# Altium project PCB_RMII_Dongle.PrjPcb
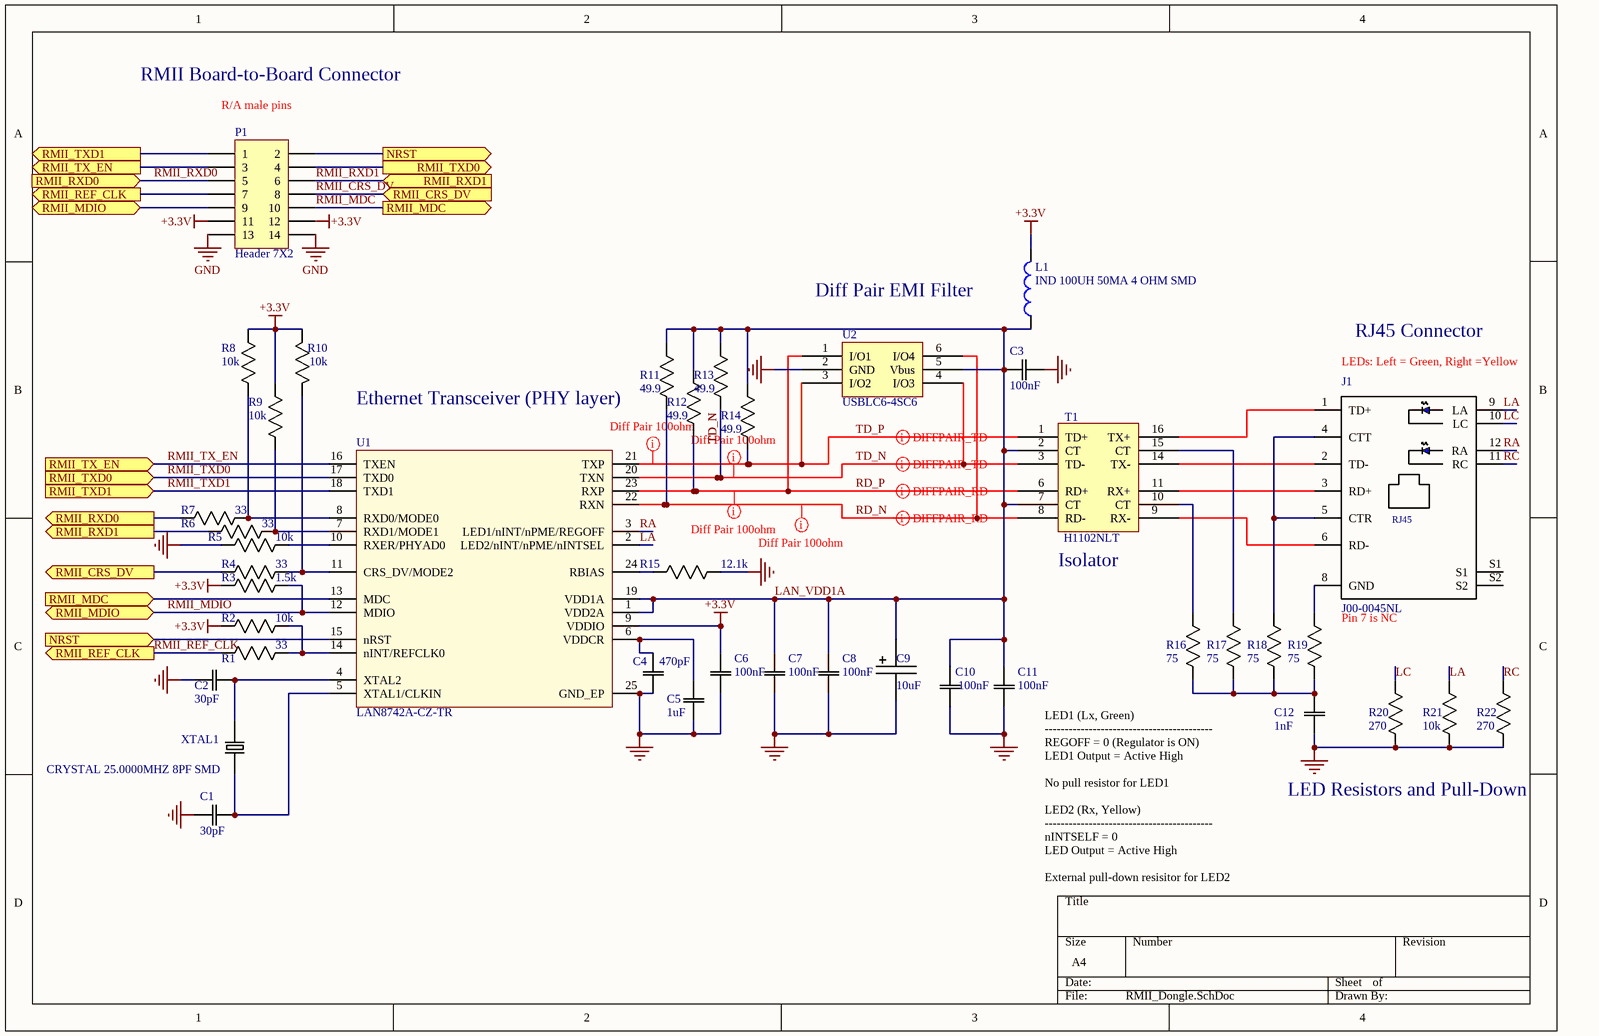
[diagram p0: RMII_Dongle.SchDoc]
1 sheet, 41 parts. Net scope: flat (ports and power ports of the same name join across sheets).
Board file: RMII_Dongle.PcbDoc

## Sheet RMII_Dongle.SchDoc
size A4

### Parts
C1  30pF  [0805]
C2  30pF  [0805]
C3  100nF  [0805]
C4  470pF  [0805]
C5  1uF  [0805]
C6  100nF  [0805]
C7  100nF  [0805]
C8  100nF  [0805]
C9  10uF  [1206 Polarized]
C10  100nF  [0805]
C11  100nF  [0805]
C12  1nF  [0805]
J1  J00-0045NL  [RJ45 J00-0045NL]
L1  IND 100UH 50MA 4 OHM SMD  [0805]
P1  Header 7X2  [HDR2X7]
R1  33  [0805]
R2  10k  [0805]
R3  1.5k  [0805]
R4  33  [0805]
R5  10k  [0805]
R6  33  [0805]
R7  33  [0805]
R8  10k  [0805]
R9  10k  [0805]
R10  10k  [0805]
R11  49.9  [0805]
R12  49.9  [0805]
R13  49.9  [0805]
R14  49.9  [0805]
R15  12.1k  [0805]
R16  75  [0805]
R17  75  [0805]
R18  75  [0805]
R19  75  [0805]
R20  270  [0805]
R21  10k  [0805]
R22  270  [0805]
T1  H1102NLT  [TRANSFORMER]
U1  LAN8742A-CZ-TR  [24-QFN (4x4)]
U2  USBLC6-4SC6  [SOT23-6L]
XTAL1  CRYSTAL 25.0000MHZ 8PF SMD  [SMD-2]

### Ports
NRST (in), NRST (out), RMII_CRS_DV (in), RMII_CRS_DV (out), RMII_MDC (in), RMII_MDC (out), RMII_MDIO (bidir), RMII_REF_CLK (out), RMII_RXD0 (in), RMII_RXD0 (out), RMII_RXD1 (in), RMII_RXD1 (out), RMII_TX_EN (in), RMII_TX_EN (out), RMII_TXD0 (in), RMII_TXD0 (out), RMII_TXD1 (in), RMII_TXD1 (out)

### Nets
+3.3V: C6.2(C2) L1.2 P1.11 P1.12 R2.2(R2) R3.2(R2) R8.1(R1) R9.1(R1) R10.1(R1) U1.9(VDDIO)
GND: C1.1(C1) C2.1(C1) C3.2(C2) C4.1(C1) C5.1(C1) C6.1(C1) C7.1(C1) C8.1(C1) C9.2(P$2) C10.1(C1) C11.1(C1) C12.1(C1) P1.13 P1.14 R5.2(R2) R15.1(R1) R20.2(R2) R21.2(R2) R22.2(R2) U1.25(GND_EP) U2.2(GND)
LA: J1.9(LA) R21.1(R1) U1.2(LED2/nINT/nPME/nINTSEL)
LAN_VDD1A: C3.1(C1) C7.2(C2) C8.2(C2) C9.1(P$1) C10.2(C2) C11.2(C2) L1.1 R11.1(R1) R12.1(R1) R13.1(R1) R14.1(R1) T1.2(CT) T1.7(CT) U1.1(VDD2A) U1.19(VDD1A) U2.5(Vbus)
LC: J1.10(LC) R20.1(R1)
RA: J1.12(RA) U1.3(LED1/nINT/nPME/REGOFF)
RC: J1.11(RC) R22.1(R1)
RD_N: R11.2(R2) T1.8(RD-) U1.22(RXN) U2.6(I/O4)
RD_P: R12.2(R2) T1.6(RD+) U1.23(RXP) U2.1(I/O1)
RMII_CRS_DV: P1.8 R4.2(R2) ; port RMII_CRS_DV
RMII_MDC: P1.10 U1.13(MDC) ; port RMII_MDC
RMII_MDIO: P1.9 R3.1(R1) U1.12(MDIO) ; port RMII_MDIO
RMII_REF_CLK: P1.7 R1.2(R2) ; port RMII_REF_CLK
RMII_RXD0: P1.5 R7.2(R2) ; port RMII_RXD0
RMII_RXD1: P1.6 R6.2(R2) ; port RMII_RXD1
RMII_TX_EN: P1.3 U1.16(TXEN) ; port RMII_TX_EN
RMII_TXD0: P1.4 U1.17(TXD0) ; port RMII_TXD0
RMII_TXD1: P1.1 U1.18(TXD1) ; port RMII_TXD1
TD_N: R13.2(R2) T1.3(TD-) U1.20(TXN) U2.4(I/O3)
TD_P: R14.2(R2) T1.1(TD+) U1.21(TXP) U2.3(I/O2)
NetC1_2: C1.2(C2) U1.5(XTAL1/CLKIN) XTAL1.1
NetC2_2: C2.2(C2) U1.4(XTAL2) XTAL1.2
NetC4_2: C4.2(C2) C5.2(C2) U1.6(VDDCR)
NetC12_2: C12.2(C2) R16.2(R2) R17.2(R2) R18.2(R2) R19.2(R2)
NetJ1_1: J1.1(TD+) T1.16(TX+)
NetJ1_2: J1.2(TD-) T1.14(TX-)
NetJ1_3: J1.3(RD+) T1.11(RX+)
NetJ1_4: J1.4(CTT) J1.5(CTR) R18.1(R1)
NetJ1_6: J1.6(RD-) T1.9(RX-)
NetJ1_8: J1.8(GND) R19.1(R1)
NetP1_2: P1.2 U1.15(nRST) ; port NRST
NetR1_1: R1.1(R1) R2.1(R1) U1.14(nINT/REFCLK0)
NetR4_1: R4.1(R1) R10.2(R2) U1.11(CRS_DV/MODE2)
NetR5_1: R5.1(R1) U1.10(RXER/PHYAD0)
NetR6_1: R6.1(R1) R9.2(R2) U1.7(RXD1/MODE1)
NetR7_1: R7.1(R1) R8.2(R2) U1.8(RXD0/MODE0)
NetR15_2: R15.2(R2) U1.24(RBIAS)
NetR16_1: R16.1(R1) T1.10(CT)
NetR17_1: R17.1(R1) T1.15(CT)

Not connected (* = marked no-connect by the designer): J1 S1 S2

### Layout directives
differential pair: RD_N, RD_P, TD_N, TD_P
rule Matched Net Lengths [Tolerance = 100mil]: RD_N, RD_P, TD_N, TD_P

### Notes on the sheet
- RMII Board-to-Board Connector
- (near P1) R/A male pins
- (near L1) Diff Pair EMI Filter
- (near J1) LEDs: Left = Green, Right =Yellow
- RJ45 Connector
- (near R11) Ethernet Transceiver (PHY layer)
- (near T1) Isolator
- Pin 7 is NC
- LED Resistors and Pull-Down
- LED1 (Lx, Green)
  ------------------------------------------
  REGOFF = 0 (Regulator is ON)
  LED1 Output = Active High
  No pull resistor for LED1
  LED2 (Rx, Yellow)
  ------------------------------------------
  nINTSELF = 0
  LED Output = Active High
  External pull-down resisitor for LED2
- (in symbol J00-0045NL) RJ45

### Library data of the parts
C1 C2 = CAP 30pF 0805: CAP CER 30PF 25V NP0 0805; MP: C0805C300M3GAC7800; MF: Yageo; Tolerance: 20%; Package: 0805; Price: 0.43 CAD; Value: 30pF; Digikey: 399-17444-1-ND; Digikey Link: https://www.digikey.ca/product-detail/en/kemet/C0805C300M3GAC7800/399-17444-1-ND/8570411; Rating: 25V
C3 C6-C8 C10 C11 = CAP 100nF 0805: CAP CER 0.1UF 50V X7R 0805; MP: CC0805KRX7R9BB104; MF: Yageo; Tolerance: 10%; Package: 0805; Price: 0,119 CAD; Value: 100nF; Digikey: 311-1140-1-ND; Digikey Link: https://www.digikey.ca/products/en?keywords=311-1140-1-ND; Rating: 50V
C4 = CAP 470pF 0805: CAP CER 470PF 50V C0G/NPO 0805; MP: CC0805JRNPO9BN471; MF: Yageo; Tolerance: 5%; Package: 0805; Price: 0,135 CAD; Value: 470pF; Digikey: 311-1119-1-ND; Digikey Link: https://www.digikey.ca/products/en?keywords=311-1119-1-ND; Rating: 50V
C5 = CAP 1uF 0805: CAP CER 1UF 50V X7R 0805; MP: CL21B105KBFNNNE; MF: Samsung Electro-Mechanics; Tolerance: 10%; Package: 0805; Price: 0,172 CAD; Value: 1uF; Digikey: 1276-1029-1-ND; Digikey Link: https://www.digikey.ca/product-detail/en/samsung-electro-mechanics/CL21B105KBFNNNE/1276-1029-1-ND/3889115; Rating: 50V
C9 = CAP TANT 10UF 1206: 10µF Molded Tantalum Capacitors 10V 1206 (3216 Metric) 3.8Ohm; MP: T491A106K010AT; MF: KEMET; Price: 0.59 CAD; Package: 1206 KEMET; Value: 10uF; Digikey: 399-3684-1-ND; Digikey Link: https://www.digikey.ca/product-detail/en/kemet/T491A106K010AT/399-3684-1-ND/819009
C12 = CAP 1nF 0805: CAP CER 1000PF 50V X7R 0805; MP: CC0805KRX7R9BB102; MF: Yageo; Tolerance: 10%; Package: 0805; Price: 0.1 CAD; Value: 1nF; Digikey: 311-1127-1-ND; Digikey Link: https://www.digikey.ca/products/en?keywords=311-1127-1-ND; Rating: 50V
J1 = J00-0045NL: 1 Port RJ45 Magjack Connector Through Hole 10/100 Base-TX, AutoMDIX; MF: Pulse Electronics; Package: None; SnapEDA_Link: https://www.snapeda.com/parts/J00-0045NL/Pulse%20Electronics%20Network/view-part/87956/?ref=snap; MP: J00-0045NL; Value: *; Digikey Link: https://www.digikey.com/product-detail/en/pulse-electronics-network/J00-0045NL/553-1619-5-ND/1036860?utm_source=snapeda&utm_medium=aggregator&utm_campaign=symbol; Digikey: 553-1619-5-ND
L1 = IND 100UH 50MA 4 OHM SMD: 100µH Unshielded Wirewound Inductor 50mA 4Ohm 0805 (2012 Metric); MF: Taiyo Yuden; MP: LBR2012T101K; Revision: July-2002: Re-released for DXP Platform.; Value: 100uH; Digikey: 587-2048-1-ND; Digikey Link: https://www.digikey.ca/product-detail/en/taiyo-yuden/LBR2012T101K/587-2048-1-ND/1788995
P1 = Header 7X2: Header, 7-Pin, Dual row; LatestRevisionDate: 17-Jul-2002; LatestRevisionNote: Re-released for DXP Platform.; Publisher: Altium Limited
R1 R4 R6 R7 = RES 33 0805: RES SMD 33 OHM 1% 1/8W 0805; MP: RC0805FR-0733RL; MF: Yageo; Rating: 0.125W; Digikey: 311-33.0CRCT-ND; Price: 0.15 CAD; Package: 0805; Value: 33; Digikey Link: https://www.digikey.ca/product-detail/en/yageo/RC0805FR-0733RL/311-33.0CRCT-ND/730809
R2 R5 R8-R10 R21 = RES 10k 0805: RES SMD 10K OHM 1% 1/8W 0805; MP: RC0805FR-0710KL; MF: Yageo; Rating: 0.125W; Digikey: 311-10.0KCRCT-ND; Price: 0.061 CAD; Package: 0805; Value: 10k; Digikey Link: https://www.digikey.ca/products/en?keywords=311-10.0KCRCT-ND; Tolerance: 1%
R3 = RES 1.5k 0805: RES SMD 1.5K OHM 1% 1/8W 0805; MP: RC0805FR-071K5L; MF: Yageo; Rating: 0.125W; Digikey: 311-1.50KCRCT-ND; Price: 0.15 CAD; Package: 0805; Value: 1.5k; Digikey Link: https://www.digikey.ca/product-detail/en/yageo/RC0805FR-071K5L/311-1.50KCRCT-ND/730443; Tolerance: 1%; ComponentLink1Description: digikey; ComponentLink1URL: https://www.digikey.ca/en/products/detail/panasonic-electronic-components/ERJ-6ENF1022V/111476
R11-R14 = RES 49.9 0805: RES SMD 49.9 OHM 1% 1/8W 0805; MP: RC0805FR-0749R9L; MF: Yageo; Rating: 0.125W; Digikey: 311-49.9CRCT-ND; Price: 0.15 CAD; Package: 0805; Value: 49.9; Digikey Link: https://www.digikey.ca/product-detail/en/yageo/RC0805FR-0749R9L/311-49.9CRCT-ND/730931; Tolerance: 1%
R15 = RES 12.1k 0805: RES SMD 12.1K OHM 1% 1/8W 0805; MP: RC0805FR-0712K1L; MF: Yageo; Rating: 0.125W; Digikey: 311-12.1KCRCT-ND; Price: 0.15 CAD; Package: 0805; Value: 12.1k; Digikey Link: https://www.digikey.ca/product-detail/en/yageo/RC0805FR-0712K1L/311-12.1KCRCT-ND/730517; Tolerance: 1%
R16-R19 = RES 75 0805: RES SMD 75 OHM 1% 1/8W 0805; MP: RC0805FR-0775RL; MF: Yageo; Rating: 0.125W; Digikey: 311-75.0CRCT-ND; Price: 0.15 CAD; Package: 0805; Value: 75; Digikey Link: https://www.digikey.ca/product-detail/en/yageo/RC0805FR-0775RL/311-75.0CRCT-ND/731079; Tolerance: 1%
R20 R22 = RES 270 0805: RES SMD 270 OHM 5% 1/8W 0805; MP: RC0805JR-07270RL; MF: Yageo; Rating: 0.125W; Digikey: 311-270ARCT-ND; Price: 0.054 CAD; Package: 0805; Value: 270; Digikey Link: https://www.digikey.ca/product-detail/en/yageo/RC0805JR-07270RL/311-270ARCT-ND/731238
T1 = H1102NLT: Isolation and Data Interface _Encapsulated_ Pulse Transformer 1:1 Transmitter, 1:1 Receiver Surface Mount; MF: Pulse Electronics; Package: SOIC-16; Price: 7.99 CAD; MP: H1102NL; Digikey: 553-1323-5-ND; Digikey Link: https://www.digikey.ca/en/products/detail/pulse-electronics-network/H1102NL/1036940?s=N4IgTCBcDaIBIEYEAYwDkAyIC6BfIA
U1 = LAN8742A-CZ-TR: LAN8742A-CZ-TR - Small Footprint RMII 10/100 Ethernet, Transceiver with HP Auto-MDIX and flexPWR Technology SQFN-24; MF: Microchip Technology; MP: LAN8742A-CZ-TR; Digikey: LAN8742A-CZ-CT-ND; Digikey Link: https://www.digikey.ca/product-detail/en/microchip-technology/LAN8742A-CZ-TR/LAN8742A-CZ-CT-ND/8256089
XTAL1 = XTAL 25MHZ 8PF SMD: 25MHz ±50ppm Crystal 8pF 70 Ohms 2-SMD, No Lead; MP: NX5032GA-25.000000MHZ-LN-CD-1; MF: NDK America, Inc.; ESR: 70 Ohms; Package: 2-SMD, No Lead; Price: 0.95 CAD; Frequency: 25MHz; Digikey: 644-1041-1-ND; Digikey Link: https://www.digikey.ca/product-detail/en/ndk-america-inc/NX5032GA-25.000000MHZ-LN-CD-1/644-1041-1-ND/1128913; Load Capacitance: 8pF